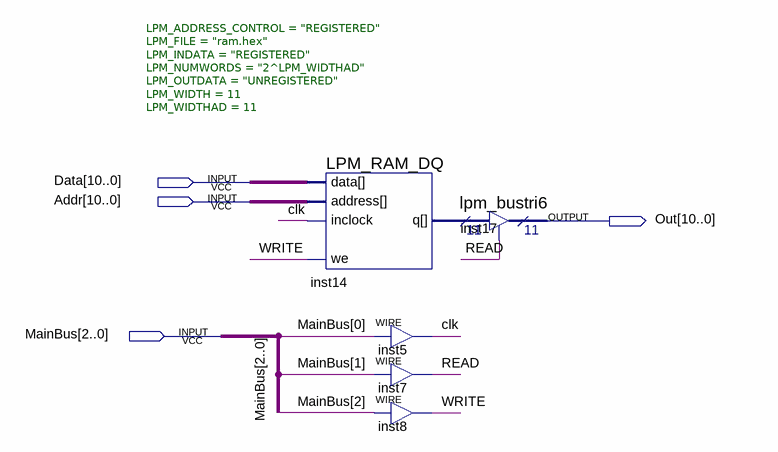
[diagram p0: schematic sheet]
// Quartus schematic RAMMemory.bdf as structural Verilog: 5 symbols, 4 pins
module RAMMemory (
  input  [10:0] Data,
  input  [10:0] Addr,
  input  [2:0] MainBus,
  output [10:0] Out
);

  wire clk, READ, WRITE;
  wire [10:0] inst14_q;

  LPM_RAM_DQ #(.LPM_ADDRESS_CONTROL("REGISTERED"), .LPM_FILE("ram.hex"), .LPM_INDATA("REGISTERED"), .LPM_NUMWORDS("2^LPM_WIDTHAD"), .LPM_OUTDATA("UNREGISTERED"), .LPM_WIDTH(11), .LPM_WIDTHAD(11)) inst14 (
    .inclock(clk), .data(Data), .address(Addr), .we(WRITE), .q(inst14_q));
  assign clk = MainBus[0];  // WIRE inst5
  assign READ = MainBus[1];  // WIRE inst7
  assign WRITE = MainBus[2];  // WIRE inst8
  lpm_bustri6 inst17 (.enabledt(READ), .data(inst14_q), .tridata(Out));
endmodule
